# Altium schematic sheet Reflectometer_Sheet.SchDoc
size A3; SheetNumber: 1; SheetTotal: 1
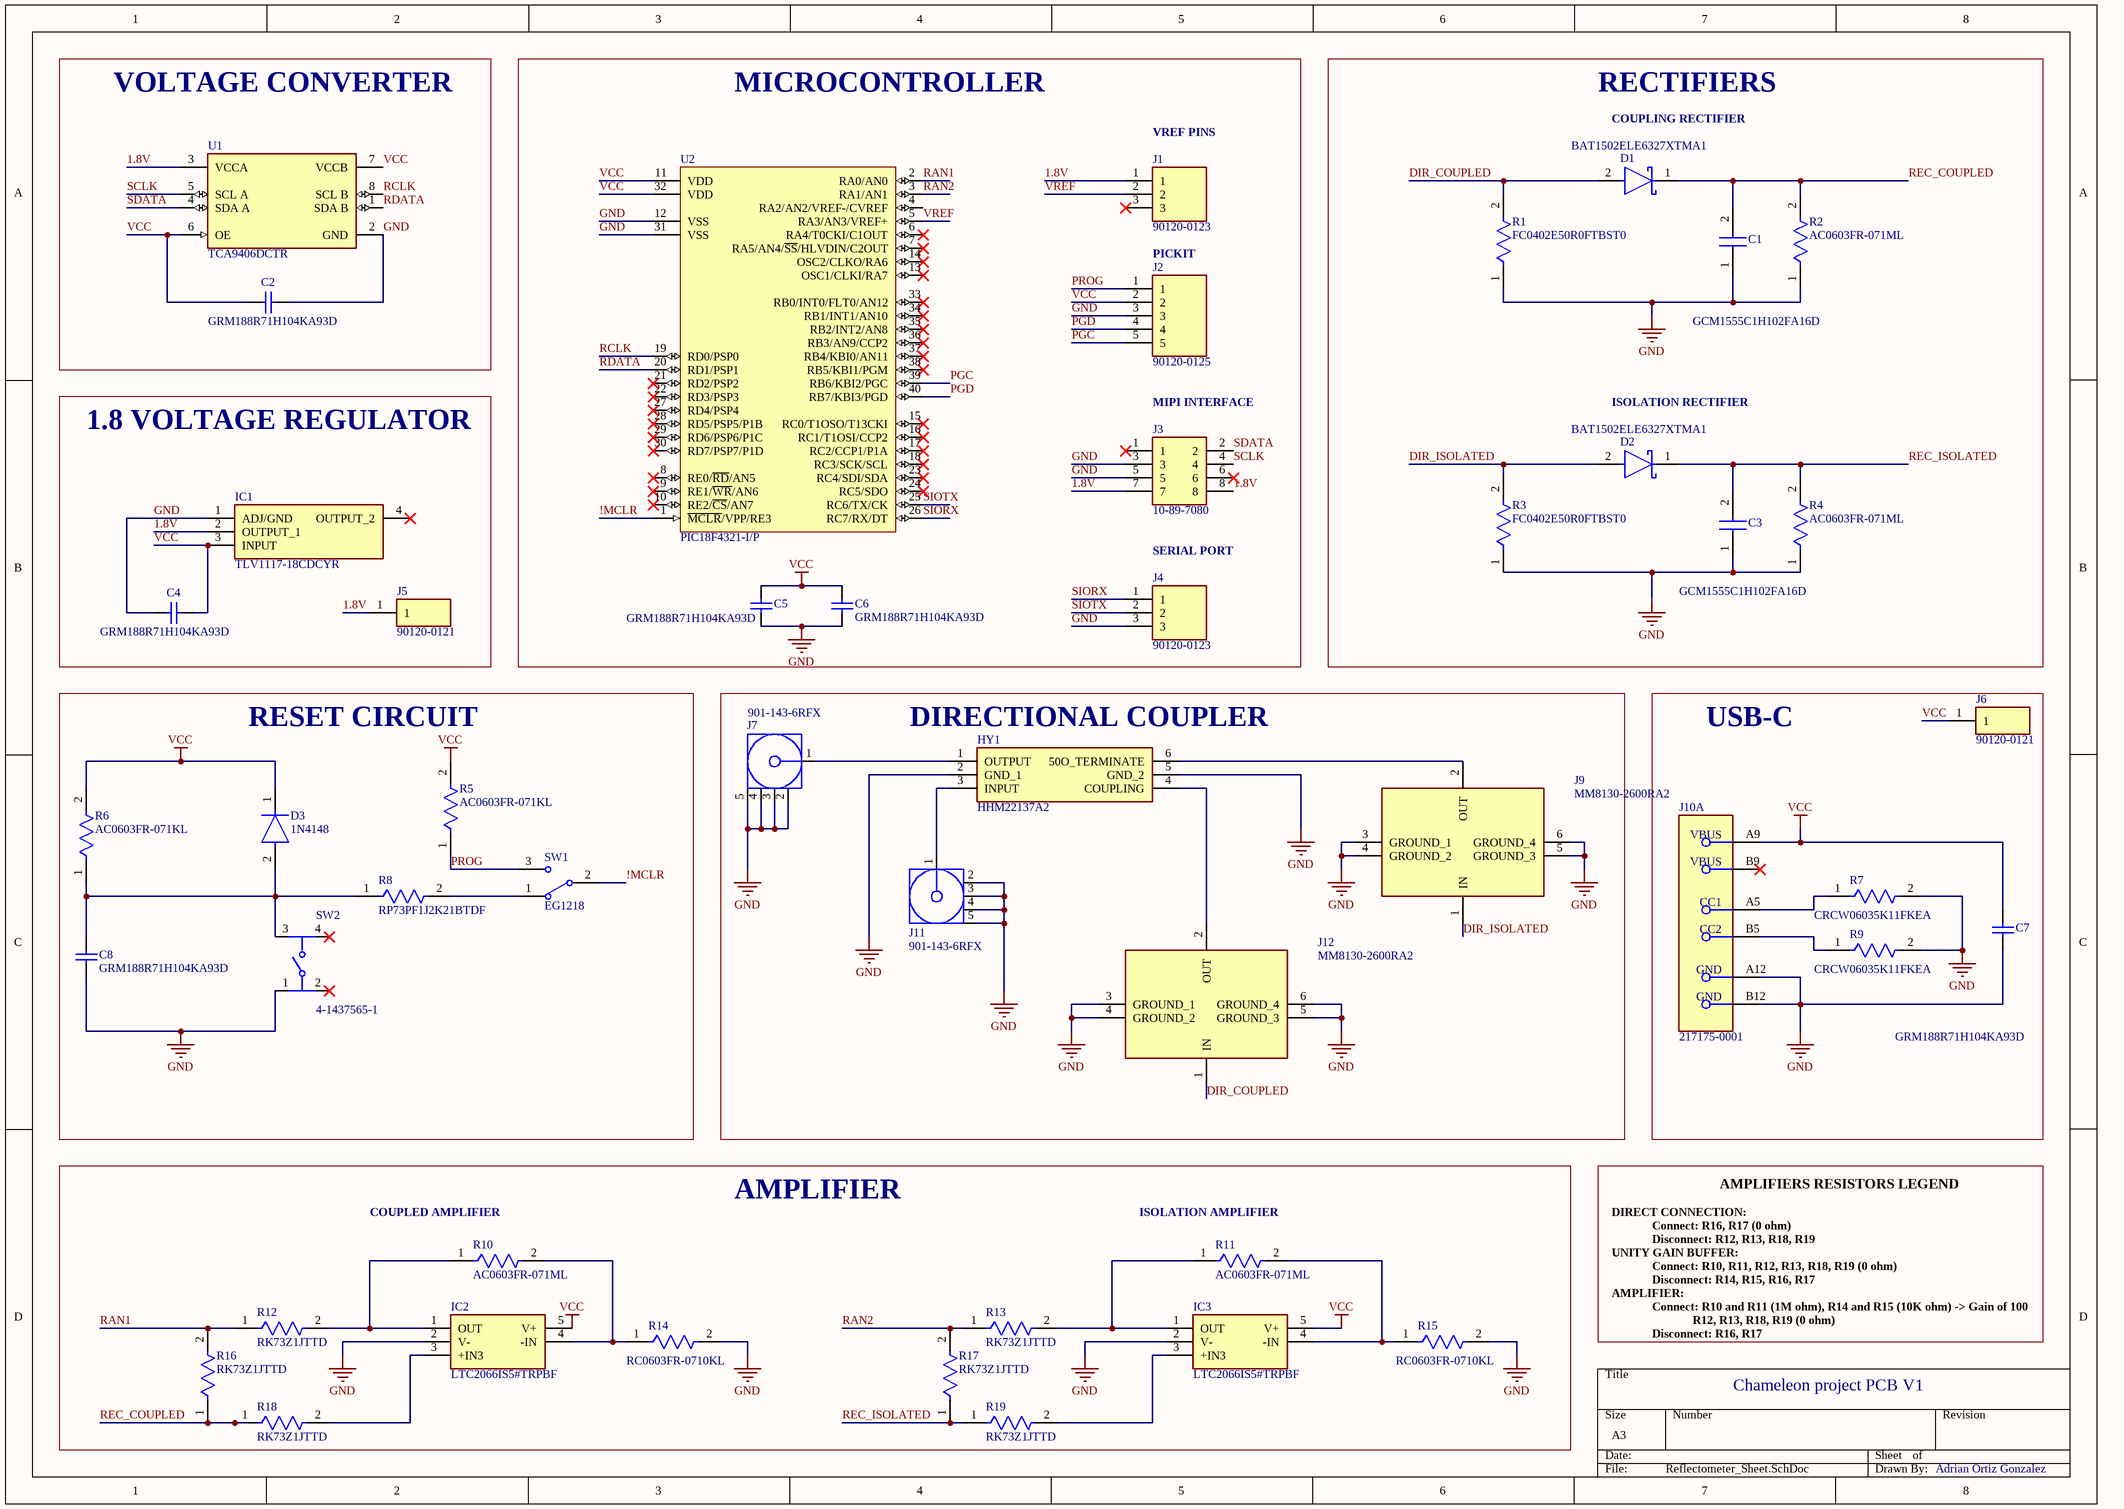
[diagram p0: Reflectometer_Sheet.SchDoc]

## Parts
C1  GCM1555C1H102FA16D  [GCM155]
C2  GRM188R71H104KA93D  [CAPC1608X90X35ML10T15]
C3  GCM1555C1H102FA16D  [GCM155]
C4  GRM188R71H104KA93D  [CAPC1608X90X35ML10T15]
C5  GRM188R71H104KA93D  [CAPC1608X90X35ML10T15]
C6  GRM188R71H104KA93D  [CAPC1608X90X35ML10T15]
C7  GRM188R71H104KA93D  [CAPC1608X90X35ML10T15]
C8  GRM188R71H104KA93D  [CAPC1608X90X35ML10T15]
D1  BAT1502ELE6327XTMA1  [FP-PG-TSLP-2-MFG]
D2  BAT1502ELE6327XTMA1  [FP-PG-TSLP-2-MFG]
D3  1N4148  [FP-017AG-MFG]
HY1  HHM22137A2  [HHM22137A2]
IC1  TLV1117-18CDCYR  [SOT230P700X180-4N]
IC2  LTC2066IS5#TRPBF  [LTC2066IS5TRPBF]
IC3  LTC2066IS5#TRPBF  [LTC2066IS5TRPBF]
J1  90120-0123  [HDRV3W90P0X254_1X3_762X249X560P]
J2  90120-0125  [HDRV5W90P0X254_1X5_1270X250X965P]
J3  10-89-7080  [HDRV8W87P254_2X4_1029X508X864P]
J4  90120-0123  [HDRV3W90P0X254_1X3_762X249X560P]
J5  90120-0121  [HDRV1W65P0X254_1X1_232X249X560P]
J6  90120-0121  [HDRV1W65P0X254_1X1_232X249X560P]
J7  901-143-6RFX  [AMPH-901-143-6RFX_V]
J9  MM8130-2600RA2  [MM81302600RA2]
J10  217175-0001  [FP-217175-0001-MFG]  (part A of 2)
J11  901-143-6RFX  [AMPH-901-143-6RFX_V]
J12  MM8130-2600RA2  [MM81302600RA2]
R1  FC0402E50R0FTBST0  [FP-FC0402-MFG]
R2  AC0603FR-071ML  [FP-AC0603-IPC_C]
R3  FC0402E50R0FTBST0  [FP-FC0402-MFG]
R4  AC0603FR-071ML  [FP-AC0603-IPC_C]
R5  AC0603FR-071KL  [FP-AC0603-IPC_B]
R6  AC0603FR-071KL  [FP-AC0603-IPC_B]
R7  CRCW06035K11FKEA  [FP-CRCW0603-e3-IPC_B]
R8  RP73PF1J2K21BTDF  [FP-RP73P-1J-MFG]
R9  CRCW06035K11FKEA  [FP-CRCW0603-e3-IPC_B]
R10  AC0603FR-071ML  [FP-AC0603-IPC_C]
R11  AC0603FR-071ML  [FP-AC0603-IPC_C]
R12  RK73Z1JTTD  [FP-RK73Z1J-MFG]
R13  RK73Z1JTTD  [FP-RK73Z1J-MFG]
R14  RC0603FR-0710KL  [FP-RC0603-0_55-IPC_C]
R15  RC0603FR-0710KL  [FP-RC0603-0_55-IPC_C]
R16  RK73Z1JTTD  [FP-RK73Z1J-MFG]
R17  RK73Z1JTTD  [FP-RK73Z1J-MFG]
R18  RK73Z1JTTD  [FP-RK73Z1J-MFG]
R19  RK73Z1JTTD  [FP-RK73Z1J-MFG]
SW1  EG1218  [ESWI-EG1218_V]
SW2  4-1437565-1  [FP-4-1437565-1-MFG]
U1  TCA9406DCTR  [FP-DCT0008A-MFG]
U2  PIC18F4321-I/P  [PDIP600-P40]

## Blocks framed on the sheet
VOLTAGE CONVERTER: C2 U1
MICROCONTROLLER: C5 C6 J1-J4 U2
RECTIFIERS: C1 C3 D1 D2 R1-R4
1.8 VOLTAGE REGULATOR: C4 IC1 J5
RESET CIRCUIT: C8 D3 R5 R6 R8 SW1 SW2
DIRECTIONAL COUPLER: HY1 J7 J9 J11 J12
USB-C: C7 J6 J10 R7 R9
AMPLIFIER: IC2 IC3 R10-R19

## Nets
GND: C1.1 C2.2 C3.1 C4.1 C5.1 C6.1 C7.1 C8.1 HY1.2(GND_1) HY1.5(GND_2) IC1.1(ADJ/GND) IC2.2(V-) IC3.2(V-) J2.3 J3.3 J3.5 J4.3 J7.2 J7.3 J7.4 J7.5 J9.3(GROUND_1) J9.4(GROUND_2) J9.5(GROUND_3) J9.6(GROUND_4) J10.A12(GND) J10.B12(GND) J11.2 J11.3 J11.4 J11.5 J12.3(GROUND_1) J12.4(GROUND_2) J12.5(GROUND_3) J12.6(GROUND_4) R1.1 R2.1 R3.1 R4.1 R7.2 R9.2 R14.2 R15.2 SW2.1 U1.2(GND) U2.12(VSS) U2.31(VSS)
VCC: C2.1 C4.2 C5.2 C6.2 C7.2 D3.1(C) IC1.3(INPUT) IC2.5(V+) IC3.5(V+) J2.2 J6.1 J10.A9(VBUS) R5.2 R6.2 U1.6(OE) U1.7(VCCB) U2.11(VDD) U2.32(VDD)
1.8V: IC1.2(OUTPUT_1) J1.1 J3.7 J3.8 J5.1 U1.3(VCCA)
!MCLR: SW1.2(COM) U2.1(~{MCLR}/VPP/RE3)
DIR_COUPLED: D1.2(A) J12.1(IN) R1.2
DIR_ISOLATED: D2.2(A) J9.1(IN) R3.2
PGC: J2.5 U2.39(RB6/KBI2/PGC)
PGD: J2.4 U2.40(RB7/KBI3/PGD)
PROG: J2.1 R5.1 SW1.3
RAN1: R12.1 R16.2 U2.2(RA0/AN0)
RAN2: R13.1 R17.2 U2.3(RA1/AN1)
RCLK: U1.8(SCL_B) U2.19(RD0/PSP0)
RDATA: U1.1(SDA_B) U2.20(RD1/PSP1)
REC_COUPLED: C1.2 D1.1(C) R2.2 R16.1 R18.1
REC_ISOLATED: C3.2 D2.1(C) R4.2 R17.1 R19.1
SCLK: J3.4 U1.5(SCL_A)
SDATA: J3.2 U1.4(SDA_A)
SIORX: J4.1 U2.26(RC7/RX/DT)
SIOTX: J4.2 U2.25(RC6/TX/CK)
VREF: J1.2 U2.5(RA3/AN3/VREF+)
NetC8_2: C8.2 D3.2(A) R6.1 R8.1 SW2.3
NetHY1_1: HY1.1(OUTPUT) J7.1
NetHY1_3: HY1.3(INPUT) J11.1
NetHY1_4: HY1.4(COUPLING) J12.2(OUT)
NetHY1_6: HY1.6(50O_TERMINATE) J9.2(OUT)
NetIC2_1: IC2.1(OUT) R10.1 R12.2
NetIC2_3: IC2.3(+IN3) R18.2
NetIC2_4: IC2.4(-IN) R10.2 R14.1
NetIC3_1: IC3.1(OUT) R11.1 R13.2
NetIC3_3: IC3.3(+IN3) R19.2
NetIC3_4: IC3.4(-IN) R11.2 R15.1
NetJ10_A5: J10.A5(CC1) R7.1
NetJ10_B5: J10.B5(CC2) R9.1
NetR8_2: R8.2 SW1.1

Not connected (* = marked no-connect by the designer): IC1 4(OUTPUT_2)*; J1 3*; J3 1* 6*; J10 B9(VBUS)*; SW2 2* 4*; U2 4(RA2/AN2/VREF-/CVREF) 6(RA4/T0CKI/C1OUT)* 7(RA5/AN4/~{SS}/HLVDIN/C2OUT)* 8(RE0/~{RD}/AN5)* 9(RE1/~{WR}/AN6)* 10(RE2/~{CS}/AN7)* 13(OSC1/CLKI/RA7)* 14(OSC2/CLKO/RA6)* 15(RC0/T1OSO/T13CKI)* 16(RC1/T1OSI/CCP2)* 17(RC2/CCP1/P1A)* 18(RC3/SCK/SCL)* 21(RD2/PSP2)* 22(RD3/PSP3)* 23(RC4/SDI/SDA)* 24(RC5/SDO)* 27(RD4/PSP4)* 28(RD5/PSP5/P1B)* 29(RD6/PSP6/P1C)* 30(RD7/PSP7/P1D)* 33(RB0/INT0/FLT0/AN12)* 34(RB1/INT1/AN10)* 35(RB2/INT2/AN8)* 36(RB3/AN9/CCP2)* 37(RB4/KBI0/AN11)* 38(RB5/KBI1/PGM)*

## Notes on the sheet
- (near J1) VREF PINS
- COUPLING RECTIFIER
- PICKIT
- MIPI INTERFACE
- ISOLATION RECTIFIER
- SERIAL PORT
- AMPLIFIERS RESISTORS LEGEND
- (near R10) COUPLED AMPLIFIER
- (near R11) ISOLATION AMPLIFIER
- DIRECT CONNECTION:
- UNITY GAIN BUFFER:
- Connect: R16, R17 (0 ohm)
- Disconnect: R12, R13, R18, R19
- AMPLIFIER:
- Connect: R10, R11, R12, R13, R18, R19 (0 ohm)
- Disconnect: R14, R15, R16, R17
- Connect: R10 and R11 (1M ohm), R14 and R15 (10K ohm) -> Gain of 100
- R12, R13, R18, R19 (0 ohm)
- Disconnect: R16, R17
- Chameleon project PCB V1
- Adrian Ortiz Gonzalez

## Library data of the parts
C1 C3 = GCM1555C1H102FA16D: Capacitor; Manufacturer_Name: Murata Electronics; Datasheet Link: https://search.murata.co.jp/Ceramy/image/img/A01X/G101/ENG/GCM1555C1H102FA16-01A.pdf; Height: 0.55mm; Manufacturer_Part_Number: GCM1555C1H102FA16D; Mouser Part Number: 81-GCM1555C1H102FA6D; Mouser Price/Stock: https://www.mouser.co.uk/ProductDetail/Murata-Electronics/GCM1555C1H102FA16D?qs=QzBtWTOodeXpE1CTmLdqWQ%3D%3D; Arrow Part Number: GCM1555C1H102FA16D; Arrow Price/Stock: https://www.arrow.com/en/products/gcm1555c1h102fa16d/murata-manufacturing?utm_currency=USD&region=nac
C2 C4-C8 = CMP-2100-03643-1: Chip Capacitor, 0.1 uF, +/- 10%, 50 V, -55 to 125 degC, 0603 (1608 Metric), RoHS, Tape and Reel; Manufacturer: Murata; Dielectric Material: Ceramic; Voltage Rating: 50V; Capacitance: 100nF; Dielectric: X7R; Insulation Resistance: 10GR; Case Code (Metric): 1608; Lead Free: LeadFree; Depth: 0.8mm; Number of Pins: 2; Radiation Hardening: No; Case/Package: 0603; Manufacturer URL: http://www.murata.com/; Packaging: TapeandReel; Length: 1.6mm; Contact Plating: Tin; Datasheet URL: http://psearch.en.murata.com/capacitor/product/GRM188R71H104KA93%23.pdf; Tolerance: 10%; Case Code (Imperial): 0603; Min Operating Temperature: -55degC; RoHSCompliant: true; Voltage: 50V; Termination: SMD/SMT; Mount: SurfaceMount; Material: Ceramic; Package Quantity: 1; Height: 0.8mm; Thickness: 0.035inch; REACH SVHC: NoSVHC; Max Operating Temperature: 125degC; Width: 0.8mm; Package Reference: 0603; Voltage Rating (DC): 50V; Datasheet Version: 42675.0; Package Description: 2-Pin Surface Mount Device, Body 1.6 x 0.8 mm
D1 D2 = CMP-32890-000023-1: DIODE SCHOT 4V 110MA TSLP-2-19; Mount: Surface Mount; Series: -; Packaging: Tape and Reel; Max Reverse Voltage (DC): 4V; RoHS Compliant: Yes; Average Rectified Current: 110mA; Number of Pins: 2
D3 = CMP-07163-000046-1: DIODE GEN PURP 100V 200MA DO35; Forward Voltage: 1V; Max Power Dissipation: 500mW; Max Reverse Current: 5uA; Forward Current: 300mA; Current: 4A; Reverse Recovery Time: 4ns; Element Configuration: Single; Outside Diameter: 1.85mm; Capacitance: 4pF; Polarity: Standard; Max Forward Surge Current (Ifsm): 1A; Reverse Voltage: 100V; Output Current: 200mA; Average Rectified Current: 200mA; Diameter: 1.91mm; Max Repetitive Reverse Voltage (Vrrm): 100V; Current Rating: 200mA; Case/Package: DO-35; Lead Free: Lead Free; Number of Pins: 2; Recovery Time: 4ns; Packaging: Bulk; Contact Plating: Tin; Voltage: 100V; Mount: Through Hole; Max Surge Current: 4A; Package Quantity: 2000; Width: 1.91mm; Max Reverse Voltage (DC): 100V; Length: 4.56mm; Radiation Hardening: No; Power Dissipation: 500mW; Voltage Rating (DC): 100V; Peak Non-Repetitive Surge Current: 4A; REACH SVHC: No SVHC; Height: 4.56mm; Max Operating Temperature: 175°C; Series: -; Weight: 0.01lb; Min Operating Temperature: -65°C
HY1 = HHM22137A2: Circulator or Directional Coupler; Manufacturer_Name: TDK; Datasheet Link: https://product.tdk.com/system/files/dam/doc/product/rf/rf/coupler/catalog/rf_coupler_hhm22137a2_en.pdf; Height: 0.7mm; Manufacturer_Part_Number: HHM22137A2; Mouser Part Number: 810-HHM22137A2; Mouser Price/Stock: https://www.mouser.co.uk/ProductDetail/TDK/HHM22137A2?qs=r5DSvlrkXmK2QL4NHLRRxA%3D%3D; Arrow Part Number: HHM22137A2; Arrow Price/Stock: https://www.arrow.com/en/products/hhm22137a2/tdk?region=nac
IC1 = TLV1117-18CDCYR: Integrated Circuit; Manufacturer_Name: Texas Instruments; Datasheet Link: http://www.ti.com/lit/gpn/tlv1117; Height: 1.8mm; Manufacturer_Part_Number: TLV1117-18CDCYR; Mouser Part Number: 595-TLV1117-18CDCYR; Mouser Price/Stock: https://www.mouser.co.uk/ProductDetail/Texas-Instruments/TLV1117-18CDCYR?qs=p6lVfQR1GSrzaPtAyljZjg%3D%3D; Arrow Part Number: TLV1117-18CDCYR; Arrow Price/Stock: https://www.arrow.com/en/products/tlv1117-18cdcyr/texas-instruments?utm_currency=USD&region=nac
IC2 IC3 = LTC2066IS5#TRPBF: Integrated Circuit; Manufacturer_Name: Analog Devices; Datasheet Link: https://datasheet.datasheetarchive.com/originals/distributors/Datasheets_SAMA/388e27b14637626e2a3022813c6e3131.pdf; Height: 1mm; Manufacturer_Part_Number: LTC2066IS5#TRPBF; Mouser Part Number: 584-LTC2066IS5TRPBF; Mouser Price/Stock: https://www.mouser.co.uk/ProductDetail/Analog-Devices/LTC2066IS5TRPBF?qs=W0yvOO0ixfEc%2F9Y03vKLXg%3D%3D; Arrow Part Number: LTC2066IS5#TRPBF; Arrow Price/Stock: https://www.arrow.com/en/products/ltc2066is5trpbf/analog-devices
J1 J4 = 90120-0123: Connector; Manufacturer_Name: Molex; Datasheet Link: https://componentsearchengine.com/Datasheets/1/90120-0123.pdf; Height: 5.6mm; Manufacturer_Part_Number: 90120-0123; Mouser Part Number: 538-90120-0123; Mouser Price/Stock: https://www.mouser.co.uk/ProductDetail/Molex/90120-0123?qs=P7cO%252B%252BFDLzTpWo7m4GGnKQ%3D%3D
J2 = 90120-0125: Connector; Manufacturer_Name: Molex; Datasheet Link: http://uk.rs-online.com/web/p/products/6705035; Height: 9.65mm; Manufacturer_Part_Number: 90120-0125; Mouser Part Number: 538-90120-0125; Mouser Price/Stock: https://www.mouser.co.uk/ProductDetail/Molex/90120-0125?qs=PvP5v7EimsnRuMCT76O3cg%3D%3D
J3 = 10-89-7080: Connector; Manufacturer_Name: Molex; Datasheet Link: https://www.molex.com/en-us/products/part-detail/10897080?display=pdf; Height: 8.64mm; Manufacturer_Part_Number: 10-89-7080; Mouser Part Number: 538-10-89-7080; Mouser Price/Stock: https://www.mouser.co.uk/ProductDetail/Molex/10-89-7080?qs=oWQp3ZoCHH1Sk1PvWFbV4w%3D%3D
J5 J6 = 90120-0121: Connector; Manufacturer_Name: Molex; Datasheet Link: https://www.molex.com/pdm_docs/sd/901200121_sd.pdf; Height: 5.6mm; Manufacturer_Part_Number: 90120-0121; Mouser Part Number: 538-90120-0121; Mouser Price/Stock: https://www.mouser.co.uk/ProductDetail/Molex/90120-0121?qs=PvP5v7Eimskix228j1Tf%2FQ%3D%3D
J7 J11 = CMP-2000-05705-1: Coaxial connector, 50 Ohm, -65 to 165 degC, 5-Pin THD, RoHS, Bulk; Manufacturer: Amphenol; Catalog Drawings: 901-143-6RFXMountingHole; 3D Model: 901-143-6RFX.igs; Body Material: Brass; Connector Type: Jack,FemaleSocket; Shield Termination: Solder; Other Names: 901-143-6-RFX9011436RFXARFX1232; Online Catalog: SMA,RFX; Frequency - Max: 18GHz; Body Finish: Gold; Dielectric Material: Polytetrafluoroethylene(PTFE); Center Contact Material: BerylliumCopper; Impedance: 50Ohm; Connector Style: SMA; Mounting Technology: ThroughHole; Mounting Type: ThroughHole,RightAngle; Cable Group: -; Series: -; Package Description: 5-Pin Through Hole Device, Body 7 x 7 mm, Pitch 2.54 mm; Package Reference: 901-143-6RFX; Voltage Rating: -; Standard Package: 1; Fastening Type: Threaded; Housing Color: Gold; Datasheet URL: http://www.amphenolrf.com/downloads/dl/file/id/2712/product/3102/901_143_6rfx_customer_drawing.pdf; Family: CoaxialConnectors(RF); Contact Termination: Solder; Manufacturer URL: http://www.amphenol.com/; Operating Temperature: -65°C~165°C; Category: Connectors,Interconnects; Packaging: Bulk; Features: -; Center Contact Plating: Gold; Datasheet Version: Rev. C, 06/2010; Ingress Protection: -
J9 J12 = MM8130-2600RA2: Connector; Manufacturer_Name: Murata Electronics; Datasheet Link: https://www.murata.com/-/media/webrenewal/support/library/catalog/products/connector/o30e.ashx?la=en-gb&cvid=20230202042145000000; Height: 1.5mm; Manufacturer_Part_Number: MM8130-2600RA2; Mouser Part Number: 81-MM8130-2600RA2; Mouser Price/Stock: https://www.mouser.co.uk/ProductDetail/Murata-Electronics/MM8130-2600RA2?qs=pwh76yelNxAj%2FSz0%2FLo03A%3D%3D; Arrow Part Number: MM8130-2600RA2; Arrow Price/Stock: https://www.arrow.com/en/products/mm8130-2600ra2/murata-manufacturing?utm_currency=USD&region=nac
J10 = CMP-04767-000026-1: CONN RCP USB2.0 C 6+18P SMD RA
R1 R3 = CMP-00030-23258606-1: FC0402E50R0FTBST0 SMD Chip Resistor, 50 Ohm, ± 1%, 50 mW, 0402 [1005 Metric], Thin Film, High Frequency; Temperature Coefficient: 25ppm/°C; Resistance: 50Ω; Voltage Rating: 30V; Power Rating: 50mW; Depth: 510µm; Case/Package: 0402; NexarPartId: 23258606; RoHS: Compliant; Termination: SMD/SMT; Min Operating Temperature: -55°C; Military Standard: Not; Length: 1.016mm; Max Operating Temperature: 125°C; Mount: Surface Mount; Height: 381µm; Radiation Hardening: No; Packaging: Tape and Reel; Tolerance: 1%; Composition: Thin Film
R2 R4 R10 R11 = CMP-2000-04829-2: RES 1MΩ 1.00% 0.1W 0603; Voltage Rating: 50V; Tolerance: 1%; Max Power Dissipation: 100mW; Resistance: 1MR; Temperature Coefficient: 100ppm/°C; Length: 0.063inch; Packaging: Tape and Reel; Number of Terminations: 2; Width: 0.031inch; Case/Package: 0603; Max Operating Temperature: 155°C; Height: 0.022inch; Termination: SMD/SMT; Series: AC; Min Operating Temperature: -55°C; Case Code (Metric): 1608; Resistor Type: Thick Film; Power Rating: 100mW; Case Code (Imperial): 0603; RoHS Compliant: Yes; Features: Moisture Resistant; Lead Free: Lead Free; Package Quantity: 1; Ratings: AEC-Q200
R5 R6 = CMP-2000-04828-3: RES 1kΩ 1.00% 0.1W 0603; Voltage Rating: 50V; Power Rating: 100mW; Tolerance: 1%; Temperature Coefficient: 100ppm/°C; Resistance: 1kR; Depth: 0.8mm; Case/Package: 0603; Size Code: 0603; Case Code (Metric): 1608; Height: 0.022inch; Series: AC; Width: 0.031inch; Construction: Rectangular; Length: 0.063inch; Case Code (Imperial): 0603; Package Quantity: 1; RoHS Compliant: Yes; Features: Moisture Resistant; Resistor Type: Thick Film; Max Power Dissipation: 100mW; Packaging: Tape and Reel; Termination: SMD/SMT; Ratings: AEC-Q200; Max Operating Temperature: 155°C; Min Operating Temperature: -55°C; Military Standard: Not; Lead Free: Lead Free; Number of Terminations: 2
R7 R9 = CMP-2000-03482-2: RES Thick Film, 5.11kΩ, 1%, 0.1W, 100ppm/°C, 0603; Voltage Rating (DC): 75V; Resistance: 5.11kR; Power Rating: 100mW; Height: 0.45mm; Radiation Hardening: No; Package Quantity: 5000; Min Operating Temperature: -55°C; Weight: 7.1E-05oz; Military Standard: Not; Packaging: Tape and Reel; Max Operating Temperature: 155°C; Number of Terminations: 2; Case Code (Metric): 1608; Case Code (Imperial): 0603; Composition: Thick Film; Contact Plating: Tin; Lead Free: Lead Free; Temperature Coefficient: 100ppm/°C; Voltage Rating: 75V; Working Voltage: 75V; Tolerance: 1%; Case/Package: 0603; Depth: 0.85mm; Length: 1.55mm; Width: 0.85mm; Termination: SMD/SMT
R8 = CMP-03211-008097-1: RES SMD 2.21K OHM 0.1% 1/6W 0603; Manufacturer: TE Connectivity; Voltage Rating: 100V; Power Rating: 0.166W; Temperature Coefficient: 25ppm/°C; Resistance: 2.21KΩ; Value: 2.21KΩ; Tolerance: 0.001; Automotive: No; ComponentLink2Description: Datasheet; Manufacturer Part Number: RP73PF1J2K21BTDF; RoHS: TRUE; Composition: Thin Film; Height: 0.55mm; Digikey Description: RES SMD 2.21K OHM 0.1% 1/6W 0603; ComponentLink2URL: https://www.te.com/commerce/DocumentDelivery/DDEController?Action=srchrtrv&DocNm=1773272&DocType=DS&DocLang=English; Temperature: -55°C to +155°C; Ipc Land Pattern Name: RESC15580X45; Package: RP73P-1J; Device Class L1: Passive Components; Device Class L3: Chip SMD Resistors; Series: RP73P; Temperature Range High: +155°C; Lead Free: Yes; Device Class L2: Resistors; Temperature Range Low: -55°C; Octopart: https://octopart.com/rp73pf1j2k21btdf-te+connectivity-23826919; Category: Res
R12 R13 R16-R19 = CMP-2000-01769-2: RES 0 OHM JUMPER 0603; Resistance: 0mR; Power Rating: 1W; Tolerance: 1%; Temperature Coefficient: 400ppm/°C; Width: 0.8mm; Case/Package: 0603; RoHS Compliant: Yes; Min Operating Temperature: -55°C; Length: 1.6mm; Termination: SMD/SMT; Package Quantity: 5000; Packaging: Tape and Reel; Military Standard: Not; Series: RK73Z; Construction: Rectangular; Case Code (Metric): 1608; Resistor Type: Thick Film; Case Code (Imperial): 0603; Lead Free: Lead Free; Max Operating Temperature: 155°C; Depth: 0.8mm; Height: 0.45mm
R14 R15 = CMP-2100-03664-2: RES 10K OHM 1% 1/10W 0603; Voltage Rating: 75V; Voltage Rating (DC): 50V; Resistance: 10kR; Power Rating: 100mW; Temperature Coefficient: 100ppm/°C; Depth: 0.8mm; Termination: SMD/SMT; Resistor Type: Thick Film; Series: RC; Construction: Rectangular; Features: Moisture Resistant; Packaging: Tape and Reel; Min Operating Temperature: -55°C; Number of Terminations: 2; Lead Pitch: 0.3mm; RoHS Compliant: Yes; Case/Package: 0603; Resistance Tolerance: 1%; Military Standard: Not; Weight: 7.1E-05oz; Number of Pins: 2; Tolerance: 1%; Length: 1.6mm; Case Code (Imperial): 0603; Lead Free: Lead Free; Width: 0.8mm; Max Power Dissipation: 100mW; Height: 0.45mm; Max Operating Temperature: 155°C; Case Code (Metric): 1608; Size Code: 0603
SW1 = CMP-1696-00002-1: Slide Switch, 500 V, -20 to 70 degC, 3-Pin THD, RoHS; Case\Package: SOT-23-5; Output Current: 150 mA; Nominal Output Voltage: 3.3 V; Max Power Dissipation: 250 mW; Min Input Voltage: 4.3 V; Outputs: 1; Max Input Voltage: 8 V; Dropout Voltage: 300 mV; PackageDescription: 3-Pin Through Hole Device, Body 11.6 x 4 mm, Pitch 2.5 mm; ComponentLink1URL: http://www.e-switch.ch/en/; RoHSCompliant: true; Length: 3 mm; ComponentLink1Description: Manufacturer URL; Power Rating: 250 mW; Mount: Surface Mount; Max Operating Temperature: 85 degC; REACH SVHC: No SVHC; Radiation Hardening: No; Height: 1.3 mm; Pins: 5; Max Ouput Current: 150 mA; Output Voltage: 3.3 V; Width: 1.8 mm; Package Quantity: 3000; ComponentLink2URL: https://www.e-switch.com/system/asset/product_line/data_sheet/119/EG.pdf; Min Operating Temperature: -40 degC; ComponentLink2Description: Datasheet; DatasheetVersion: Oct-15; PackageReference: EG1218; Packaging: Tape and Reel
SW2 = CMP-03407-000003-1: SWITCH TACTILE SPST-NO 0.05A 24V; Manufacturer: TE Connectivity; Ciiva Ids: 2672442; Contact Current Rating: 50mA; Operating Force: 160gf; Contact Resistance: 100mΩ; Electromechanical Life: 100000Cycles; Standoff Height: 0.05mm; Import Ts: 1521848451; Category: Switch; ComponentLink2Description: Datasheet; Mount: Surface Mount; Digikey Description: SWITCH TACTILE SPST-NO 0.05A 24V; Device Class L3: Tactile Switches; Release Date: 1503379960; Octopart: https://octopart.com/fsm4jsma-te+connectivity-55488004; Temperature Range Low: -35°C; Lead Free: Yes; RoHS: TRUE; Mouser Description: Switch Tactile OFF (ON) SPST Round Button Gull Wing 0.05A 12VDC 1.57N SMD Loose Piece; Voltage Rating Dc: 24V; ComponentLink2URL: https://www.te.com/commerce/DocumentDelivery/DDEController?Action=showdoc&DocId=Customer+Drawing%7F2-1437565-7%7FV%7Fpdf%7FEnglish%7FENG_CD_2-1437565-7_V.pdf%7F4-1437565-1; Height: 5.38mm; Package: 0; Temperature Range High: +85°C; Device Class L2: Switches; Manufacturer Part Number: 4-1437565-1; Temperature: -35°C to +85°C; Device Class L1: Electromechanical; Automotive: No; Throw Configuration: SPST-NO
U1 = CMP-0314-00292-3: IC TRNSLTR BIDIRECTIONAL SM8; Output Type: Voltage; Low Level Output Current: 50mA; Turn-On Delay Time: 260ns; Number of Outputs: 2; Min Supply Voltage: 1.65V; High Level Output Current: -50mA; Data Rate: 24Mbps; Logic Function: Translator; Max Supply Voltage: 5.5V; Propagation Delay: 4.4ns; Packaging: Tape and Reel; Number of Channels: 2; Width: 2.9mm; REACH SVHC: No SVHC; Height: 1.2mm; Number of Bits: 2; Number of Pins: 8; Lead Free: Lead Free; RoHS Compliant: Yes; Case/Package: SSOP; Weight: 0.000705oz; Max Operating Temperature: 85°C; Contact Plating: Gold; Min Operating Temperature: -40°C; Radiation Hardening: No; Series: -; Length: 3.15mm; Package Quantity: 1
U2 = CMP-0116-00016-1: Enhanced Flash Microcontroller with 10-Bit A/D and nanoWatt Technology, 8K Flash, 40-Pin PDIP, Industrial Temperature Range; PackageVersion: revBB, Aug-2009; PackageReference: PDIP600-P40; DatasheetVersion: revE, Feb-2007; PackageDescription: 40-Lead Plastic Dual In-Line (P) - 600 mil Body [PDIP]